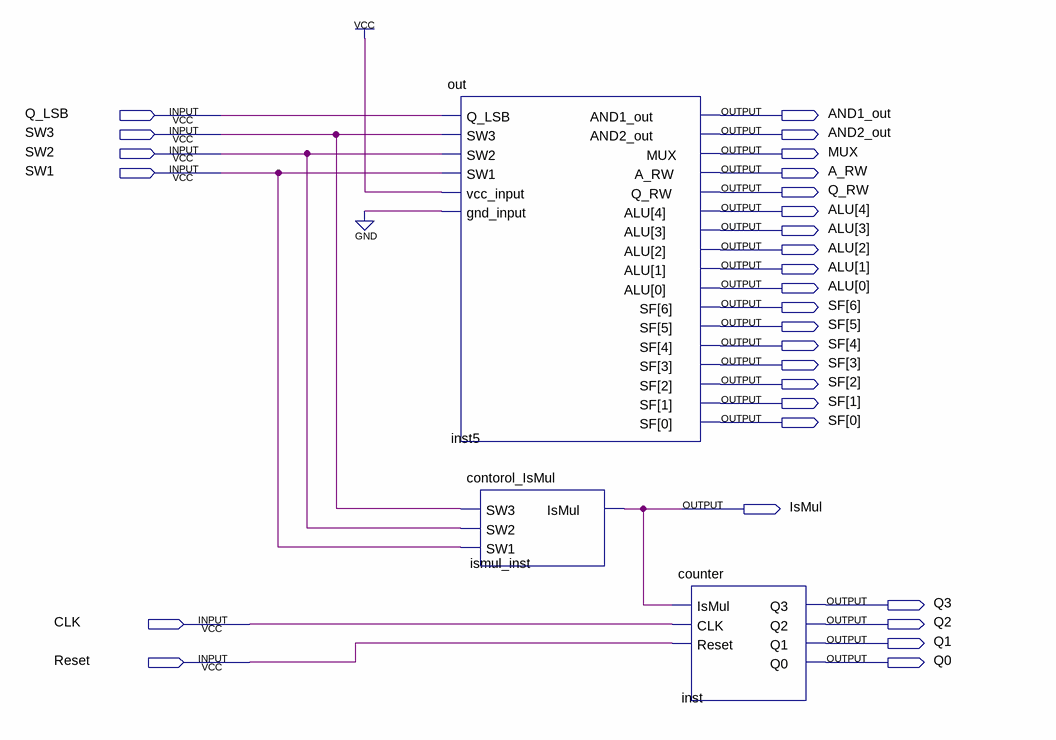
[diagram p0: schematic sheet]
// Quartus schematic control.bdf as structural Verilog: 3 symbols, 28 pins
module control (
  input  Q_LSB,
  input  SW3,
  input  SW2,
  input  SW1,
  input  CLK,
  input  Reset,
  output AND1_out,
  output AND2_out,
  output MUX,
  output A_RW,
  output Q_RW,
  output [4:0] ALU,
  output [6:0] SF,
  output IsMul,
  output Q3,
  output Q2,
  output Q1,
  output Q0
);

  out inst5 (
    .Q_LSB(Q_LSB), .SW3(SW3), .SW2(SW2), .SW1(SW1), .vcc_input(1'b1), .gnd_input(1'b0), .AND1_out(AND1_out),
    .AND2_out(AND2_out), .MUX(MUX), .A_RW(A_RW), .Q_RW(Q_RW), .ALU(ALU), .SF(SF));
  contorol_IsMul ismul_inst (.SW3(SW3), .SW2(SW2), .SW1(SW1), .IsMul(IsMul));
  counter inst (.IsMul(IsMul), .CLK(CLK), .Reset(Reset), .Q3(Q3), .Q2(Q2), .Q1(Q1), .Q0(Q0));
endmodule
